# Altium schematic sheet KS2E_PCHG_LVSIDE.SchDoc
size A; SheetNumber: 2; SheetTotal: 3
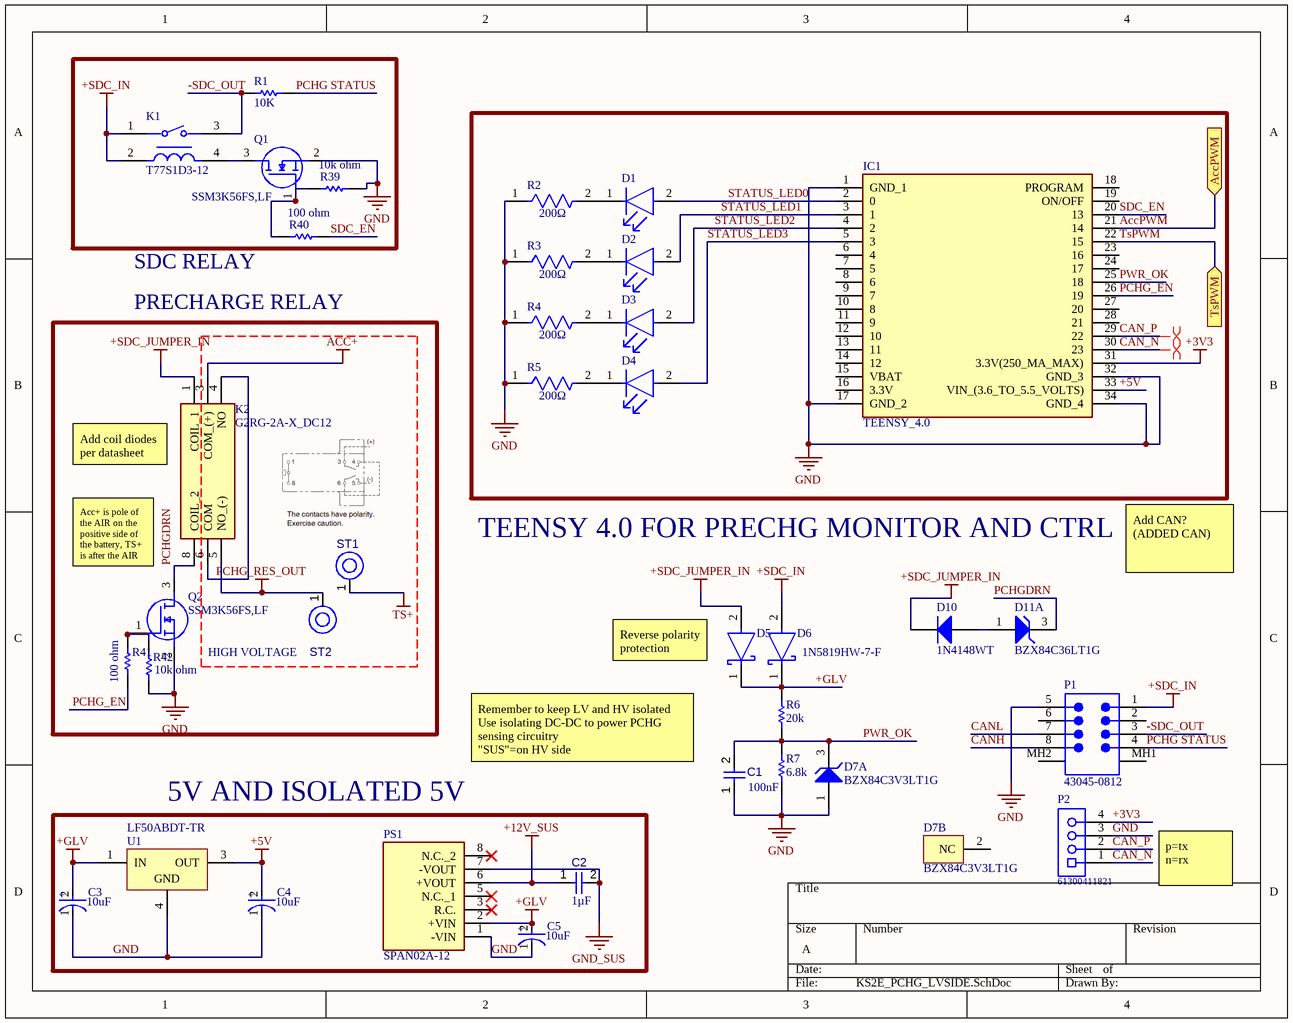
[diagram p0: KS2E_PCHG_LVSIDE.SchDoc]

## Parts
C1  value 100nF  [CAPC1608X90X40NL10T20]  (hidden comment: Capacitor 100 nF +/-10% 50 V 0603)
C2  value 1µF  [CAPC0603(1608)100_L]  (hidden comment: Capacitor 1µF +/-0.1% 25V 0603)
C3  Capacitance: 10uF  [FP-FKB-MFG]  (hidden comment: EEEFK1E100R)
C4  Capacitance: 10uF  [FP-FKB-MFG]  (hidden comment: EEEFK1E100R)
C5  Capacitance: 10uF  [FP-FKB-MFG]  (hidden comment: EEEFK1E100R)
D1  LTST-C193KGKT-5A  [FP-LTST-C193KGKT-5A-MFG]  (value not drawn)
D2  LTST-C193KRKT-5A  [FP-LTST-C193KRKT-5A-MFG]  (value not drawn)
D3  LTST-C193KGKT-5A  [FP-LTST-C193KGKT-5A-MFG]  (value not drawn)
D4  LTST-C193KRKT-5A  [FP-LTST-C193KRKT-5A-MFG]  (value not drawn)
D5  1N5819HW-7-F  [FP-SOD123-IPC_A]
D6  1N5819HW-7-F  [FP-SOD123-IPC_A]  (value not drawn)
D7  BZX84C3V3LT1G  [ONSC-SOT-23-3-318-08_V]  (parts A,B of 2)
D10  1N4148WT  [FAIR-SOD-523F-2_V]
D11  BZX84C36LT1G  [ONSC-SOT-23-3-318-08_V]  (part A of 2)
IC1  TEENSY_4.0  [TEENSY40]
K1  T77S1D3-12  [FP-T77S1D3-12-MFG]
K2  G2RG-2A-X_DC12  [G2RG2AXDC12]
P1  43045-0812  [MOLX-43045-0812_V]
P2  61300411821  [61300411821]
PS1  SPAN02A-12  [SPAN02A12]
Q1  SSM3K56FS,LF  [1SS423]
Q2  SSM3K56FS,LF  [1SS423]
R1  10K  [RESC1608X55X30ML15T15]
R2  Resistance: 200Ω  [FP-RN732A-MFG]  (hidden comment: RN73C2A200RBTD)
R3  Resistance: 200Ω  [FP-RN732A-MFG]  (hidden comment: RN73C2A200RBTD)
R4  Resistance: 200Ω  [FP-RN732A-MFG]  (hidden comment: RN73C2A200RBTD)
R5  Resistance: 200Ω  [FP-RN732A-MFG]  (hidden comment: RN73C2A200RBTD)
R6  20k  [RESC1608X55X30ML15T15]
R7  6.8k  [RESC1608X55X30ML15T15]
R39  10k ohm  [RESC1608X55X30LL15T15]
R40  100 ohm  [RESC1608X55X30LL15T15]
R41  100 ohm  [RESC1608X55X30LL15T15]
R42  10k ohm  [RESC1608X55X30LL15T15]
ST1  PTH-M2D5X5  [PTH-M2D5X5]  (value not drawn)
ST2  PTH-M2D5X5  [PTH-M2D5X5]  (value not drawn)
U1  LF50ABDT-TR  [TO-252_M]

## Blocks framed on the sheet
PRECHARGE RELAY: K2 Q2 R41 R42 ST1 ST2
5V AND ISOLATED 5V: C2-C5 PS1 U1

## Ports
AccPWM (in), TsPWM (in)

## Nets
+3V3: IC1.31(3.3V(250_MA_MAX)) P2.4
+5V: C4.2(A) IC1.33(VIN_(3.6_TO_5.5_VOLTS)) U1.3(OUT)
+12V_SUS: C2.1 PS1.6(+VOUT)
+GLV: C3.2(A) C5.2(A) D5.1(C) D6.1(C) PS1.2(+VIN) R6.2 U1.1(IN)
+SDC_IN: D6.2(A) K1.1 K1.2 P1.1
+SDC_JUMPER_IN: D5.2(A) D10.1(K) K2.1(COIL_1)
ACC+: K2.3(COM_(+))
GND: C1.1 C3.1(C) C4.1(C) C5.1(C) D7.1(A) IC1.1(GND_1) IC1.17(GND_2) IC1.32(GND_3) IC1.34(GND_4) P1.5 P2.3 PS1.1(-VIN) Q1.2(S) Q2.2(S) R2.1 R3.1 R4.1 R5.1 R7.1 R39.2 R42.2 U1.4(GND)
GND_SUS: C2.2 PS1.7(-VOUT)
PCHG_RES_OUT: K2.5(NO_(-)) ST2.1(H1)
TS+: ST1.1(H1)
-SDC_OUT: K1.3 P1.3 R1.2
AccPWM: IC1.21(14) ; port AccPWM
CAN_N: IC1.30(23) P2.1
CAN_P: IC1.29(22) P2.2
CANH: P1.8
CANL: P1.7
PCHG STATUS: P1.4 R1.1
PCHG_EN: IC1.26(19) R41.1
PCHGDRN: D11.3(K) K2.8(COIL_2) Q2.3(D)
PWR_OK: C1.2 D7.3(K) IC1.25(18) R6.1 R7.2
SDC_EN: IC1.20(13) R40.2
STATUS_LED0: D1.2(A) IC1.2(0)
STATUS_LED1: D2.2(A) IC1.3(1)
STATUS_LED2: D3.2(A) IC1.4(2)
STATUS_LED3: D4.2(A) IC1.5(3)
TsPWM: IC1.22(15) ; port TsPWM
NetD1_1: D1.1(C) R2.2
NetD2_1: D2.1(C) R3.2
NetD3_1: D3.1(C) R4.2
NetD4_1: D4.1(C) R5.2
NetD10_2: D10.2(A) D11.1(A)
NetK1_4: K1.4 Q1.3(D)
NetK2_4: K2.4(NO) K2.6(COM)
NetQ1_1: Q1.1(G) R39.1 R40.1
NetQ2_1: Q2.1(G) R41.2 R42.1

Not connected (* = marked no-connect by the designer): D7 2(NC); IC1 6(4) 7(5) 8(6) 9(7) 10(8) 11(9) 12(10) 13(11) 14(12) 15(VBAT) 16(3.3V) 18(PROGRAM) 19(ON/OFF) 23(16) 24(17) 27(20) 28(21); P1 2 6 MH1 MH2; PS1 3(R.C.)* 5(N.C._1)* 8(N.C._2)*

## Layout directives
differential pair: CAN_N, CAN_P

## Notes on the sheet
- SDC RELAY
- (near K2) Add coil diodes
  per datasheet
- Acc+ is pole of the AIR on the positive side of the battery, TS+ is after the AIR
- TEENSY 4.0 FOR PRECHG MONITOR AND CTRL
- Add CAN?
  (ADDED CAN)
- (near Q2) HIGH VOLTAGE
- (near D5) Reverse polarity protection
- Remember to keep LV and HV isolated
  Use isolating DC-DC to power PCHG sensing circuitry
  "SUS"=on HV side
- p=tx
  n=rx
- (in symbol CMP-05427-000055-1) +

## Library data of the parts
C1 = CMP-001-00017-6: Chip Capacitor, 100 nF, +/- 10%, 50 V, 0603 (1608 Metric); Voltage Rating: 50V; Capacitor Type: Ceramic; Tolerance: 10%; Mounting Technology: SM; Max Operating Temperature: 125°C; RoHS Compliant: True; Pins: 2; Case/Package: 0603; Min Operating Temperature: -55°C
C2 = CMP-001-00055-4: Chip Capacitor, 1µF +/-0.1%, 25V, 0603, Thickness 1 mm; Tolerance: 20%; Min Operating Temperature: -55°C; Max Operating Temperature: 85°C; Voltage Rating: 25V; Mounting Technology: SMT; Case/Package: 0603; Pins: 2
C3-C5 = CMP-05427-000055-1: CAP ALUM 10UF 20% 25V SMD; ESR (Equivalent Series Resistance): 1.35R; Life (Hours): 2000Hour; Dielectric Material: Aluminium; Leakage Current: 3uA; Ripple Current (AC): 90mA; Polarity: Polar; Voltage: 25V; Voltage Rating: 25V; Number of Pins: 2; Package Quantity: 1; Max Operating Temperature: 105°C; Tolerance: 20%; Voltage Rating (DC): 25V; Packaging: Tape and Reel; Impedance: 1.35R; Case/Package: Radial; Series: FK; Height - Seated (Max): 0.24inch; Diameter: 4mm; Length: 5.8mm; Construction: Cylindrical; Height: 5.8mm; Mount: Surface Mount; REACH SVHC: No SVHC; Termination: SMD/SMT; Lead Free: Lead Free; RoHS Compliant: Yes; Contact Plating: Tin; Width: 5.5mm; Radiation Hardening: No; Min Operating Temperature: -55°C; Ripple Current: 90mA
D1 D3 = CMP-2000-06622-2: LED GREEN CLEAR CHIP SMD; Forward Current: 30mA; Power Dissipation: 75mW; Luminous Intensity: 28mcd; Lens Style: Diffused; Lens Color: Colorless; Forward Voltage: 2.3V; Test Current: 5mA; Viewing Angle: 130°; Reverse Voltage: 5V; Dominant Wavelength: 576.5nm; Number of Elements: 1; Number of Pins: 2; Case/Package: 0603; Width: 0.8mm; Radiation Hardening: No; Lead Free: Lead Free; Lens Transparency: Clear; Max Operating Temperature: 85°C; Illumination Color: Green; Color: Green; Packaging: Tape and Reel; Depth: 0.8mm; Length: 1.6mm; Mount: Surface Mount; Case Code (Imperial): 0603; Height: 0.35mm; Min Operating Temperature: -55°C; Package Quantity: 3000; Case Code (Metric): 1608; Power Rating: 75mW; Number of LEDs: 1
D2 D4 = CMP-2000-06623-2: LED RED CLEAR CHIP SMD; Power Dissipation: 50mW; Lens Style: Diffused; Test Current: 5mA; Dominant Wavelength: 631nm; Reverse Voltage: 5V; Number of Elements: 1; Viewing Angle: 130°; Luminous Intensity: 45mcd; Lens Color: Colorless; Forward Voltage: 2.3V; Case Code (Imperial): 0603; Illumination Color: Red; Lead Free: Lead Free; Radiation Hardening: No; Width: 0.8mm; Number of Pins: 2; Packaging: Tape and Reel; Depth: 0.8mm; Height: 0.35mm; Mount: Surface Mount; Case Code (Metric): 1608; Forward Current: 5mA; Lens Transparency: Clear; Case/Package: 0603; Length: 1.6mm; Color: Red; Max Operating Temperature: 85°C; Number of LEDs: 1; Min Operating Temperature: -55°C; Package Quantity: 3000
D5 D6 = CMP-0303-00003-3: DIODE SCHOTTKY 40V 1A SOD123; Forward Voltage: 450mV; Capacitance: 110pF; Max Forward Surge Current (Ifsm): 25A; Peak Reverse Current: 50uA; Polarity: Standard; Element Configuration: Single; Max Power Dissipation: 450mW; Min Operating Temperature: -65°C; Package Quantity: 3000; Contact Plating: Tin; Weight: 0.000353oz; Max Repetitive Reverse Voltage (Vrrm): 40V; Max Reverse Voltage (DC): 40V; Height: 1.25mm; Average Rectified Current: 1A; Width: 1.7mm; Case/Package: SOD-123-2; Lead Free: Lead Free; Max Operating Temperature: 125°C; Current Rating: 1A; Termination: SMD/SMT; Forward Current: 1A; Radiation Hardening: No; Number of Pins: 2; Length: 2.85mm; Voltage Rating (DC): 40V; REACH SVHC: No SVHC; Peak Non-Repetitive Surge Current: 25A; Packaging: Tape and Reel; Output Current: 1A
D7 = CMP-1060-01189-1: Zener Voltage Regulator, 225 mW, 3-Pin SOT-23, Pb-Free, Tape and Reel; Manufacturer: On Semiconductor; ComponentLink2Description: Datasheet; ComponentLink3Description: Package Specification; PackageVersion: Rev. AP, 11/2009; ComponentLink3URL: http://www.onsemi.cn/pub_link/Collateral/318-08.PDF; Mounting Technology: Surface Mount; DatasheetVersion: Rev. 17; ComponentLink2URL: http://www.onsemi.com/pub_link/Collateral/BZX84C2V4LT1-D.PDF; PackageDescription: 3-Pin Small Outline Transistor, Body 2.92 x 1.3 mm, Pitch 0.95 mm; RoHS: Pb-Free; ComponentLink1URL: http://www.onsemi.com/; ComponentLink1Description: Manufacturer URL; PartNumber: BZX84C3V3LT1G; PackageReference: SOT-23-3-318-08; Packing: Tape and Reel
D10 = CMP-0881-00001-1: High Conductance Fast Switching Diode, 75 V, -55 to 150 degC, 2-Pin SOD523F, RoHS; Manufacturer: Fairchild Semiconductor; IR (VR: 75 V)=5 uA Max.; VF: 1 V Max.; BVR (IR: 5 uA)=75 V Min.; CO: 4 pF Max.; DatasheetVersion: Rev. A2; ComponentLink1Description: Manufacturer URL; PackageDescription: 2-Pin Surface Mount Device, Body 1.2 x 0.8 mm, Height 0.7 mm; ComponentLink2URL: http://www.fairchildsemi.com/ds/1N/1N4148WT.pdf; ComponentLink2Description: Datasheet; PartNumber: 1N4148WT; ComponentLink1URL: http://www.fairchildsemi.com/; Temperature Range: -55 to 150 degC; Mounting Technology: Surface Mount; PackageReference: SOD-523F-2; RoHS: TRUE
D11 = CMP-1060-01178-1: Zener Voltage Regulator, 225 mW, 3-Pin SOT-23, Pb-Free, Tape and Reel; Manufacturer: On Semiconductor; Packing: Tape and Reel; ComponentLink1Description: Manufacturer URL; Mounting Technology: Surface Mount; ComponentLink3URL: http://www.onsemi.cn/pub_link/Collateral/318-08.PDF; ComponentLink2Description: Datasheet; RoHS: Pb-Free; PartNumber: BZX84C36LT1G; ComponentLink1URL: http://www.onsemi.com/; PackageReference: SOT-23-3-318-08; DatasheetVersion: Rev. 17; PackageDescription: 3-Pin Small Outline Transistor, Body 2.92 x 1.3 mm, Pitch 0.95 mm; ComponentLink2URL: http://www.onsemi.com/pub_link/Collateral/BZX84C2V4LT1-D.PDF; PackageVersion: Rev. AP, 11/2009; ComponentLink3Description: Package Specification
IC1 = TEENSY_4.0: Integrated Circuit; Manufacturer_Name: Teensy; Manufacturer_Part_Number: TEENSY 4.0; Datasheet Link: https://www.pjrc.com/store/teensy40.html; Height: 4.64mm
K1 = CMP-03396-000213-1: RELAY GEN PURPOSE SPST 3A 12V; Coil Power: 200mW; Contact Voltage Rating (DC): 30V; Coil Type: Non-Latching; Voltage Rating (AC): 250V; Coil Current: 16.67mA; Relay Type: General Purpose; Approvals: UL; Coil Resistance: 720R; Release Time: 4ms; Operate Time: 10ms; RoHS Compliant: Yes; Radiation Hardening: No; Height: 14.7mm; Min Operating Temperature: -30°C; Weight: 9g; Contact Current Rating: 3A; Coil Voltage (DC): 12V; Termination: PCB; Series: T77; Depth: 10.2mm; Mount: Through Hole; Current Rating: 3A; Power Consumption: 200mW; Max Voltage Rating (DC): 30V; Number of Pins: 4; Lead Free: Lead Free; Package Quantity: 100; Max Voltage Rating (AC): 250V; Application(s): GENERAL PURPOSE; Power Rating: 200mW; Length: 0.717inch; ELV: Compliant; Width: 0.4inch; Type: Electromechanical; Throw Configuration: SPST; Packaging: Tray; Max Operating Temperature: 105°C; Contact Material: Silver
K2 = G2RG-2A-X_DC12: Relay or Contactor; Manufacturer_Name: Omron Electronics; Manufacturer_Part_Number: G2RG-2A-X DC12; Datasheet Link: https://media.digikey.com/pdf/Data%20Sheets/Omron%20PDFs/G2RG-X.pdf; Height: 29.5mm; Mouser Part Number: 653-G2RG-2A-XDC12; Mouser Price/Stock: https://www.mouser.co.uk/ProductDetail/Omron-Electronics/G2RG-2A-X-DC12?qs=DPoM0jnrROVJ0ySZlbdwjA%3D%3D
P1 = CMP-1594-00003-1: 3 mm Pitch Micro-Fit 3.0 Connector, 17.27 mm Mated Height, Vertical, Through Hole, 8 Circuits, -40 to 105 degC, RoHS, Tray; Pitch: 3 mm; No. of Positions: 8; No. of Rows: 2; ComponentLink2Description: Datasheet; ComponentLink2URL: http://www.molex.com/webdocs/datasheets/pdf/en-us/0430450812_PCB_HEADERS.pdf; Orientation: Vertical; PartNumber: 43045-0812; Packing: Tray; Temperature Min: -40 degC; RoHS: TRUE; ComponentLink3Description: Package Specification; Temperature Max: 105 degC; ComponentLink3URL: http://www.molex.com/pdm_docs/sd/430450812_sd.pdf; Mounting Technology: Through Hole; PackageVersion: Rev. F, 06/2009; ComponentLink1Description: Manufacturer URL; PackageDescription: 8-Pin PCB Header, Vertical, Pitch 3 mm, Mated Height 17.27 mm, Through Hole; ComponentLink1URL: http://www.molex.com/
P2 = CMP-1502-01316-1: THT Vertical Socket Header WR-PHD, Pitch 2.54 mm, Single Row, 4 pins; Manufacturer: Wurth Elektronik; Working Voltage: 250VAC; Rated Current: 3A; Pin Number: 4; Withstanding Voltage: 500VAC; Contact Resistance: 20mOhm; Gender: Female; Pitch: 2.54mm; Datasheet URL: https://katalog.we-online.de/em/datasheet/6130xx11821.pdf; Part Number: 61300411821; Operating Temperature: -40to125degC; Row Number: Single; Package Reference: 61300411821; Orientation: Vertical; Publisher: WurthElektronik; Packaging: Tray; Manufacturer URL: http://www.we-online.de; Mounting Technology: THT
PS1 = SPAN02A-12: Power Supply; Manufacturer_Name: Mean Well; Datasheet Link: https://datasheet.datasheetarchive.com/originals/distributors/DKDS-2/37032.pdf; Height: 11.6mm; Manufacturer_Part_Number: SPAN02A-12; Mouser Part Number: 709-SPAN02A-12; Mouser Price/Stock: https://www.mouser.co.uk/ProductDetail/MEAN-WELL/SPAN02A-12?qs=5aG0NVq1C4wxQqKsG84AkQ%3D%3D; Arrow Part Number: SPAN02A-12; Arrow Price/Stock: https://www.arrow.com/en/products/span02a-12/mean-well-enterprises?region=nac
Q1 Q2 = SSM3K56FS,LF: MOSFET (N-Channel); Manufacturer_Name: Toshiba; Datasheet Link: http://toshiba.semicon-storage.com/info/docget.jsp?did=13419&prodName=SSM3K56FS; Height: 0mm; Manufacturer_Part_Number: SSM3K56FS,LF; Mouser Part Number: 757-SSM3K56FSLF; Mouser Price/Stock: https://www.mouser.co.uk/ProductDetail/Toshiba/SSM3K56FSLF?qs=PiFplXvYe5XjAd54EjZm0w%3D%3D; Arrow Part Number: SSM3K56FS,LF; Arrow Price/Stock: https://www.arrow.com/en/products/ssm3k56fslf/toshiba?region=nac
R1 R6 R7 = CMP-2000-00318-1: Part Number: ERJ-3EKF2002V; Manufacturer: Panasonic
R2-R5 = CMP-03211-010956-1: SMD Chip Resistor, Thin Film, 200Ω, 100 V, 0805 [2012 Metric], 100 mW, 0.1%, RN73 Series; Manufacturer: TE Connectivity; Temperature Coefficient: 10ppm/°C; Power Rating: 0.1W; Voltage Rating: 100V; Package: RN732A; Temperature Range Low: -55°C; Ipc Land Pattern Name: RESC200125X55; Device Class L1: Passive Components; packaging: 5000 Reel; Device Class L2: Resistors; Height: 0.65mm; Automotive: No; Series: RN73; Temperature: -55°C to 155°C; ComponentLink2Description: Datasheet; octopart_url: https://octopart.com/rn73c2a200rbtd-te+connectivity-22736993; RoHS: TRUE; Category: Res; Value: 200Ω; Temperature Range High: 155°C; Lead Free: Yes; Tolerance: 0.1%; ComponentLink2URL: https://www.te.com/commerce/DocumentDelivery/DDEController?Action=showdoc&DocId=Data+Sheet%7F1773270%7FP%7Fpdf%7FEnglish%7FENG_DS_1773270_P.pdf%7F1676162-2; Manufacturer Part Number: RN73C2A200RBTD; Device Class L3: Chip SMD Resistors; Octopart: https://octopart.com/rn73c2a200rbtd-te+connectivity-22736993; Composition: Thin Film
R39-R42 = CMP-2000-00335-2: Chip Resistor, 220 Ohm, +/- 1%, 0.1 W, -55 to 155 degC, 0603 (1608 Metric), RoHS, Tape and Reel; Voltage Rating: 50 V; Resistance: 22 Ohm; Power Rating: 100 mW; Case\Package: 0603; ComponentLink2Description: Datasheet; PackageDescription: 2-Pin Surface Mount Device, Body 1.6 x 0.85 mm; PackageReference: 0603; ComponentLink1Description: Manufacturer URL; ComponentLink2URL: http://industrial.panasonic.com/cdbs/www-data/pdf/RDA0000/AOA0000C86.pdf; Height: 0.45 mm; Mount: Surface Mount; Case Code (Metric): 1608; Pins: 2; Width: 0.8 mm; Length: 1.6 mm; Package Quantity: 5000; Tolerance: 1%; ComponentLink1URL: http://www.panasonic.com/; Max Operating Temperature: 155 degC; Min Operating Temperature: -55 degC; RoHSCompliant: true; Packaging: Tape and Reel; Case Code (Imperial): 0603; DatasheetVersion: Apr-15; REACH SVHC: No SVHC; Voltage Rating (DC): 50 V
ST1 ST2 = CMP-00028-00004-2: M2 PTH (2.5mm), 5mm pad; Pins: 1
U1 = CMP-0244-00070-1: 500mA, Very Low Drop (0.45V) Voltage Regulator, 5V, 3-Pin DPAK, Tape and Reel; DatasheetVersion: 1/11/2010; ComponentLink1URL: http://www.st.com; ComponentLink1Description: Manufacturer URL; ComponentLink2URL: http://www.st.com/internet/com/TECHNICAL_RESOURCES/TECHNICAL_LITERATURE/DATASHEET/CD00000546.pdf; PackageReference: TO-252; PackageDescription: 3-Pin Transistor Outline Package 2.28 mm Pitch, 9.7 mm Lead Span (DPAK); ComponentLink2Description: Datasheet; PackageVersion: 2011